# Altium schematic sheet NguyenLy.SchDoc
size Legal
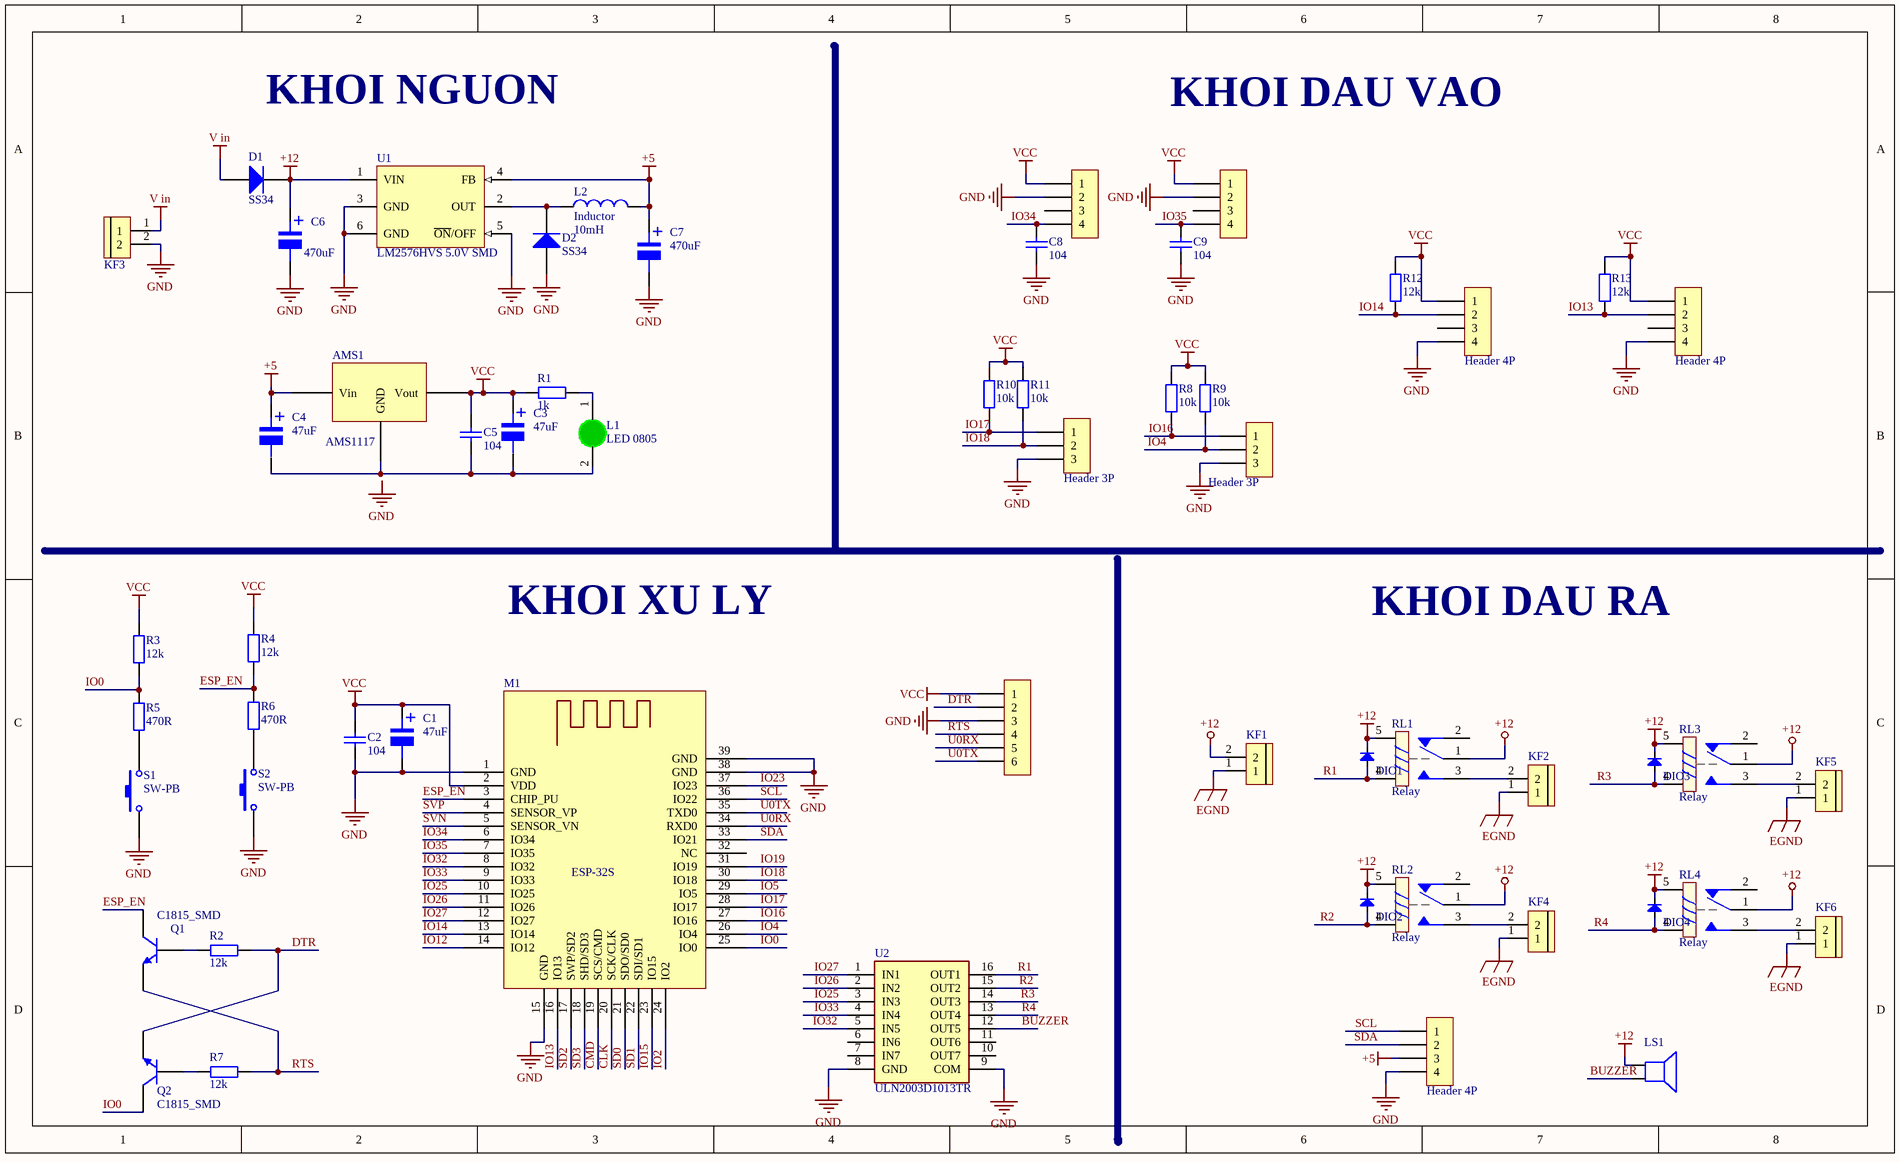
[diagram p0: NguyenLy.SchDoc]

## Parts
AMS1  AMS1117  [TO 252]
C1  47uF  [tu nhom 6.3 (d)]
C2  104  [tu 0805]
C3  47uF  [tu nhom 6.3 (d)]
C4  47uF  [tu nhom 6.3 (d)]
C5  104  [tu 0805]
C6  470uF  [tu nhom 6.3 (d)]
C7  470uF  [tu nhom 6.3 (d)]
C8  104  [tu 0805]
C9  104  [tu 0805]
D1  SS34  [DIODE SMA]
D2  SS34  [DIODE SMA]
DIO1  Diode SMD  [DIO-SMD-123]  (value not drawn)
DIO2  Diode SMD  [DIO-SMD-123]  (value not drawn)
DIO3  Diode SMD  [DIO-SMD-123]  (value not drawn)
DIO4  Diode SMD  [DIO-SMD-123]  (value not drawn)
H1  Header 6P 2.54 Duc Cong  [Header 6P DC 2.54]  (value not drawn)
H2  Header 4P  [Header 4P DC 2.54]
H3  Header 4P 2.54 Duc Cong  [Header 4P DC 2.54]  (value not drawn)
H4  Header 4P 2.54 Duc Cong  [Header 4P DC 2.54]  (value not drawn)
H5  Header 4P  [Header 4P DC 2.54]
H6  Header 4P  [Header 4P DC 2.54]
H7  Header 3P  [Header 3P DC 2.54]
H8  Header 3P  [Header 3P DC 2.54]
KF1  CON 2 KF7.62  [CON 2 KF7.62]  (value not drawn)
KF2  CON 2 KF7.62  [CON 2 KF7.62]  (value not drawn)
KF3  CON 2 KF7.62  [CON 2 KF7.62]  (value not drawn)
KF4  CON 2 KF7.62  [CON 2 KF7.62]  (value not drawn)
KF5  CON 2 KF7.62  [CON 2 KF7.62]  (value not drawn)
KF6  CON 2 KF7.62  [CON 2 KF7.62]  (value not drawn)
L1  LED 0805  [LED-0805-Green]
L2  Inductor  value 10mH  [INDC_L127H_331]
LS1  Coi Chip Speaker  [Coi Chip Speacker]  (value not drawn)
M1  ESP-32S  [ESP-32S]
Q1  C1815_SMD  [SOT23]
Q2  C1815_SMD  [SOT23]
R1  1k  [tro smd 0805]
R2  12k  [tro smd 0805]
R3  12k  [tro smd 0805]
R4  12k  [tro smd 0805]
R5  470R  [Tro SMD 0805]
R6  470R  [Tro SMD 0805]
R7  12k  [tro smd 0805]
R8  10k  [tro smd 0805]
R9  10k  [tro smd 0805]
R10  10k  [tro smd 0805]
R11  10k  [tro smd 0805]
R12  12k  [tro smd 0805]
R13  12k  [tro smd 0805]
RL1  Relay  [Relay 5 Chan SRD]
RL2  Relay  [Relay 5 Chan SRD]
RL3  Relay  [Relay 5 Chan SRD]
RL4  Relay  [Relay 5 Chan SRD]
S1  SW-PB  [SW-SMD]
S2  SW-PB  [SW-SMD]
U1  LM2576HVS 5.0V SMD  [TO263-5]
U2  ULN2003D1013TR  [SOIC16_50_284_25X90_SMT]

## Nets
+5: AMS1.3(Vin) C4.1 C7.1 H2.3 L2.2 U1.4(FB)
+12: C6.1 D1.2(K) DIO1.2(K) DIO2.2(K) DIO3.2(K) DIO4.2(K) KF1.2 LS1.1 RL1.1 RL1.5 RL2.1 RL2.5 RL3.1 RL3.5 RL4.1 RL4.5 U1.1(VIN)
EGND: KF1.1 KF2.1 KF4.1 KF5.1 KF6.1
GND: C1.2 C2.2 C6.2 C7.2 C8.2 C9.2 D2.1(A) H1.3 H2.4 H3.2 H4.2 H5.4 H6.4 H7.3 H8.3 KF3.2 M1.1(GND) M1.15(GND) M1.38(GND) M1.39(GND) S1.1 S2.1 U1.3(GND) U1.5(~{ON}/OFF) U1.6(GND) U2.8(GND) U2.9(COM)
V in: D1.1(A) KF3.1
VCC: AMS1.2(Vout) C1.1 C2.1 C3.1 C5.1 H1.1 H3.1 H4.1 H5.1 H6.1 M1.2(VDD) R1.1 R3.2 R4.2 R8.2 R9.2 R10.2 R11.2 R12.1 R13.1
BUZZER: LS1.2 U2.12(OUT5)
CLK: M1.20(SCK/CLK)
CMD: M1.19(SCS/CMD)
DTR: H1.2 Q2.2(E) R2.1
ESP_EN: M1.3(CHIP_PU) Q1.3(C) R4.1 R6.2
IO0: M1.25(IO0) Q2.3(C) R3.1 R5.2
IO2: M1.24(IO2)
IO4: H7.2 M1.26(IO4) R9.1
IO5: M1.29(IO5)
IO12: M1.14(IO12)
IO13: H6.2 M1.16(IO13) R13.2
IO14: H5.2 M1.13(IO14) R12.2
IO15: M1.23(IO15)
IO16: H7.1 M1.27(IO16) R8.1
IO17: H8.1 M1.28(IO17) R10.1
IO18: H8.2 M1.30(IO18) R11.1
IO19: M1.31(IO19)
IO23: M1.37(IO23)
IO25: M1.10(IO25) U2.3(IN3)
IO26: M1.11(IO26) U2.2(IN2)
IO27: M1.12(IO27) U2.1(IN1)
IO32: M1.8(IO32) U2.5(IN5)
IO33: M1.9(IO33) U2.4(IN4)
IO34: C8.1 H3.4 M1.6(IO34)
IO35: C9.1 H4.4 M1.7(IO35)
R1: DIO1.1(A) RL1.4 U2.16(OUT1)
R2: DIO2.1(A) RL2.4 U2.15(OUT2)
R3: DIO3.1(A) RL3.4 U2.14(OUT3)
R4: DIO4.1(A) RL4.4 U2.13(OUT4)
RTS: H1.4 Q1.2(E) R7.1
SCL: H2.1 M1.36(IO22)
SD0: M1.21(SDO/SD0)
SD1: M1.22(SDI/SD1)
SD2: M1.17(SWP/SD2)
SD3: M1.18(SHD/SD3)
SDA: H2.2 M1.33(IO21)
SVN: M1.5(SENSOR_VN)
SVP: M1.4(SENSOR_VP)
U0RX: H1.5 M1.34(RXD0)
U0TX: H1.6 M1.35(TXD0)
NetAMS1_1: AMS1.1(GND) C3.2 C4.2 C5.2 L1.2(K)
NetD2_2: D2.2(K) L2.1 U1.2(OUT)
NetKF2_2: KF2.2 RL1.3
NetKF4_2: KF4.2 RL2.3
NetKF5_2: KF5.2 RL3.3
NetKF6_2: KF6.2 RL4.3
NetL1_1: L1.1(A) R1.2
NetQ1_1: Q1.1(B) R2.2
NetQ2_1: Q2.1(B) R7.2
NetR5_1: R5.1 S1.2
NetR6_1: R6.1 S2.2

Not connected (* = marked no-connect by the designer): H3 3; H4 3; H5 3; H6 3; M1 32(NC); RL1 2; RL2 2; RL3 2; RL4 2; U2 6(IN6) 7(IN7) 10(OUT7) 11(OUT6)

## Notes on the sheet
- KHOI NGUON
- KHOI DAU VAO
- KHOI XU LY
- KHOI DAU RA
- Labels drawn without touching a wire or pin: GND
- (in symbol Tu Nhom 47uF 25V) +

## Library data of the parts
C1 C3 C4 C6 C7 = Tu Nhom 47uF 25V: Dán; Don_Vi: Con; So_Chan: 2; Ten_Linh_Kien: T? Nhôm 47uF 25V 6.3x5.5MM; Ma_Hang: MH002216; Chung_Loai: Dán; Kieu_Chan: *
C2 C5 C8 C9 = Tu 0805 104 50V 10%: Dán; Don_Vi: Con; So_Chan: 2; Ten_Linh_Kien: T? 0805 104-100nF 10% 50V; Ma_Hang: MH004551; Chung_Loai: Dán; Kieu_Chan: *
D1 D2 = Diode SS34 ( 1N5822 ): Dán; Don_Vi: Con; Ma_Hang: MH002104; Ten_Linh_Kien: Diode SS34 3A 40V SMA ( 1N5822 SS34A); Kieu_Chan: *; Chung_Loai: Dán
DIO1-DIO4 = Diode SMD: Default Diode; Code - JEDEC: DO-214-AB; Value: 1N5007; Published: 8-Jun-2000; Revision: July-2002: Re-released for DXP Platform.; Publisher: Altium Limited
H1 = Header 6P 2.54 Duc Cong: C?m; Ten_Linh_Kien: Header 6P XH2.54-6P Ð?c Cong; Don_Vi: Con; Ma_Hang: MH003363; Chung_Loai: C?m
H2-H6 = Header 4P 2.54 Duc Cong: C?m; Ten_Linh_Kien: Header 4P XH2.54-4P Ð?c Cong; Don_Vi: Con; Ma_Hang: MH001310; Chung_Loai: C?m
H7 H8 = Header 3P 2.54 Duc Cong: C?m; Ten_Linh_Kien: Header 3P XH2.54-3P Ð?c Cong; Don_Vi: Con; Ma_Hang: MH001302; Chung_Loai: C?m
KF1-KF6 = CON 2 KF7.62: C?m; Ma_Hang: MH002053; Ten_Linh_Kien: CON 2 KF7.62-2P 7.62MM (Ðen Th?ng); Chung_Loai: C?m; Ghi_Chu: *; Kieu_Chan: *; Don_Vi: Con
L1 = LED 0805 Xanh La: Dán; Don_Vi: Con; Ma_Hang: MH002326; Ten_Linh_Kien: LED 0805 Màu Xanh Lá (Green); Ghi_Chu: *; Kieu_Chan: *; Chung_Loai: Dán
L2 = Inductor: Code_IEC: 1005; Published: 8-Jun-2000; LatestRevisionDate: 29-May-2009; LatestRevisionNote: IPC-7351 Footprint Added.; PackageReference: 0402-A; Publisher: Altium Limited; PackageDescription: Chip Inductor; Code_JEITA: 0402
LS1 = Coi Chip Speaker: Còi chip
M1 = WIFI_ESP-32S
Q1 Q2 = C1815_SMD: NPN General Purpose Amplifier; Published: 8-Jun-2000; LatestRevisionDate: 15-Jan-2003; LatestRevisionNote: PCB Footprint 'BCY-W3/D4.7' replaced; DatasheetVersion: 1997; PackageVersion: Sep-1998; PackageReference: TO-92A; Publisher: Altium Limited; Code_JEDEC: TO-92A; ComponentLink1Description: Manufacturer Link; ComponentLink1URL: http://www.fairchildsemi.com/; ComponentLink2Description: Datasheet; ComponentLink2URL: http://www.fairchildsemi.com/ds/2N%2F2N3904.pdf
R1 = Tro 0805 1% 1k: Dán; Don_Vi: Con; So_Chan: 2; Ten_Linh_Kien: Tr? 0805 1% 1k; Ma_Hang: MH005468; Chung_Loai: Dán; Kieu_Chan: *
R2-R4 R7 R12 R13 = Tro 0805 5% 12k: Dán; Don_Vi: Con; So_Chan: 2; Ten_Linh_Kien: Tr? 0805 5% 12k; Ma_Hang: MH005241; Chung_Loai: Dán; Kieu_Chan: *
R5 R6 = Tro 0805 5% 470R: Dán; Don_Vi: Con; Ma_Hang: MH005341; Ten_Linh_Kien: Tr? 0805 5% 470R; So_Chan: 2; Chung_Loai: Dán; Kieu_Chan: *
R8-R11 = Tro 0805 1% 10k: Dán; Don_Vi: Con; So_Chan: 2; Ten_Linh_Kien: Tr? 0805 1% 10k; Ma_Hang: MH005473; Chung_Loai: Dán; Kieu_Chan: *
RL1-RL4 = Relay 5 Chan SRD: Relay 5 Chan; Ma_Hang: MH009374; Ten: Relay 5V10A SRD-05VDC-SL-C Chính Hãng
S1 S2 = SW-PB: Switch; Published: 24-Mar-1999; LatestRevisionDate: 17-Jul-2002; LatestRevisionNote: Re-released for DXP Platform.; PackageReference: SPST-2; Publisher: Altium Limited
U1 = LM2576HVS 5.0V SMD: Dán; Ten_Linh_Kien: LM2576HVS-5.0V BUCK 5V 3A TO263-5; Don_Vi: Con; Ma_Hang: MH002362; Ghi_Chu: *; Kieu_Chan: *; Chung_Loai: Dán
U2 = IC_ULN2003D1013TR: Bipolar (BJT) Transistor Array 7 NPN Darlington 50V 500mA Surface Mount 16-SO; Manufacturer: STMicroelectronics; Alternate Part Number-1: NA; Manufacturer Part Number: ULN2003D1013TR; Case/Package: SOIC16; Supplier-1: LCSC; Supplier Part Number-1: C61273